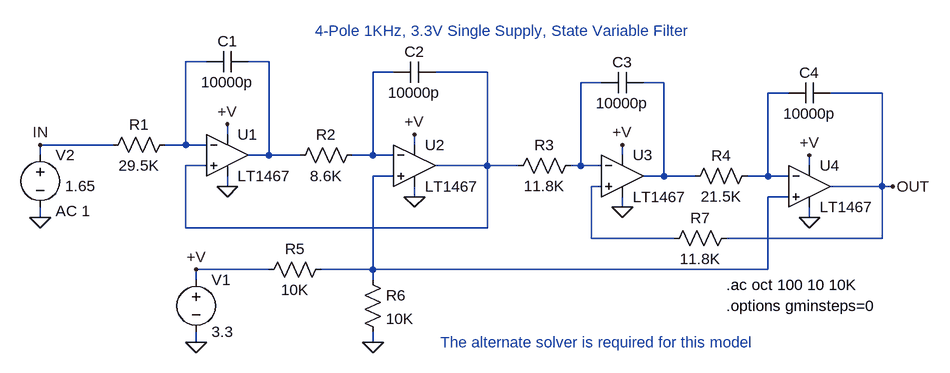
[diagram p0: schematic 1467.asc]
1467.asc, the LTspice schematic file:
Version 4
SHEET 1 1388 720
WIRE 224 -32 192 -32
WIRE 320 -32 288 -32
WIRE 512 -16 480 -16
WIRE 656 -16 576 -16
WIRE 832 0 800 0
WIRE 928 0 896 0
WIRE 1120 16 1088 16
WIRE 1264 16 1184 16
WIRE 256 80 256 64
WIRE 80 96 -32 96
WIRE 192 96 192 -32
WIRE 192 96 160 96
WIRE 224 96 192 96
WIRE 544 96 544 80
WIRE -32 112 -32 96
WIRE 320 112 320 -32
WIRE 320 112 288 112
WIRE 368 112 320 112
WIRE 480 112 480 -16
WIRE 480 112 448 112
WIRE 512 112 480 112
WIRE 864 112 864 96
WIRE 224 128 192 128
WIRE 656 128 656 -16
WIRE 656 128 576 128
WIRE 704 128 656 128
WIRE 800 128 800 0
WIRE 800 128 784 128
WIRE 832 128 800 128
WIRE 1152 128 1152 112
WIRE 512 144 480 144
WIRE 928 144 928 0
WIRE 928 144 896 144
WIRE 976 144 928 144
WIRE 1088 144 1088 16
WIRE 1088 144 1056 144
WIRE 1120 144 1088 144
WIRE 256 160 256 144
WIRE 832 160 816 160
WIRE 1264 160 1264 16
WIRE 1264 160 1184 160
WIRE 1280 160 1264 160
WIRE 544 176 544 160
WIRE 1120 176 1088 176
WIRE 864 192 864 176
WIRE -32 208 -32 192
WIRE 1152 208 1152 192
WIRE 192 224 192 128
WIRE 656 224 656 128
WIRE 656 224 192 224
WIRE 816 240 816 160
WIRE 944 240 816 240
WIRE 1264 240 1264 160
WIRE 1264 240 1024 240
WIRE 320 288 208 288
WIRE 480 288 480 144
WIRE 480 288 400 288
WIRE 1088 288 1088 176
WIRE 1088 288 480 288
WIRE 208 304 208 288
WIRE 480 304 480 288
WIRE 208 400 208 384
WIRE 480 400 480 384
FLAG 208 400 0
FLAG 256 64 +V
FLAG 208 288 +V
FLAG 1280 160 OUT
FLAG -32 96 IN
FLAG -32 208 0
FLAG 544 80 +V
FLAG 864 96 +V
FLAG 1152 112 +V
FLAG 256 160 0
FLAG 544 176 0
FLAG 864 192 0
FLAG 1152 208 0
FLAG 480 400 0
SYMBOL voltage 208 288 R0
SYMATTR InstName V1
SYMATTR Value 3.3
SYMBOL res 176 80 R90
WINDOW 0 0 56 VBottom 0
WINDOW 3 32 56 VTop 0
SYMATTR InstName R1
SYMATTR Value 29.5K
SYMBOL voltage -32 96 R0
WINDOW 123 24 102 Left 0
WINDOW 39 0 0 Left 0
WINDOW 3 38 63 Left 0
SYMATTR Value2 AC 1
SYMATTR InstName V2
SYMATTR Value 1.65
SYMBOL cap 288 -48 R90
WINDOW 0 0 32 VBottom 0
WINDOW 3 32 32 VTop 0
SYMATTR InstName C1
SYMATTR Value 10000p
SYMBOL res 464 96 R90
WINDOW 0 0 56 VBottom 0
WINDOW 3 32 56 VTop 0
SYMATTR InstName R2
SYMATTR Value 8.6K
SYMBOL cap 576 -32 R90
WINDOW 0 0 32 VBottom 0
WINDOW 3 32 32 VTop 0
SYMATTR InstName C2
SYMATTR Value 10000p
SYMBOL res 800 112 R90
WINDOW 0 0 56 VBottom 0
WINDOW 3 32 56 VTop 0
SYMATTR InstName R3
SYMATTR Value 11.8K
SYMBOL cap 896 -16 R90
WINDOW 0 0 32 VBottom 0
WINDOW 3 32 32 VTop 0
SYMATTR InstName C3
SYMATTR Value 10000p
SYMBOL res 1072 128 R90
WINDOW 0 0 56 VBottom 0
WINDOW 3 32 56 VTop 0
SYMATTR InstName R4
SYMATTR Value 21.5K
SYMBOL cap 1184 0 R90
WINDOW 0 0 32 VBottom 0
WINDOW 3 32 32 VTop 0
SYMATTR InstName C4
SYMATTR Value 10000p
SYMBOL res 416 272 R90
WINDOW 0 0 56 VBottom 0
WINDOW 3 32 56 VTop 0
SYMATTR InstName R5
SYMATTR Value 10K
SYMBOL res 464 288 R0
SYMATTR InstName R6
SYMATTR Value 10K
SYMBOL res 1040 224 R90
WINDOW 0 0 56 VBottom 0
WINDOW 3 32 56 VTop 0
SYMATTR InstName R7
SYMATTR Value 11.8K
SYMBOL opamps\\LT1467 256 48 R0
SYMATTR InstName U1
SYMBOL opamps\\LT1467 544 64 R0
SYMATTR InstName U2
SYMBOL opamps\\LT1467 864 80 R0
SYMATTR InstName U3
SYMBOL opamps\\LT1467 1152 96 R0
SYMATTR InstName U4
TEXT 1024 312 Left 0 !.ac oct 100 10 10K
TEXT 680 -64 Bottom 0 ;4-Pole 1KHz, 3.3V Single Supply, State Variable Filter
TEXT 1024 344 Left 0 !.options gminsteps=0
TEXT 584 400 Left 0 ;The alternate solver is required for this model

The netlist it stands for:
* 1467.asc
V1 +V 0 3.3
R1 N001 IN 29.5K
V2 IN 0 1.65 AC 1
C1 N002 N001 10000p
R2 N003 N002 8.6K
C2 N004 N003 10000p
R3 N005 N004 11.8K
C3 N006 N005 10000p
R4 N007 N006 21.5K
C4 OUT N007 10000p
R5 N008 +V 10K
R6 N008 0 10K
R7 OUT N009 11.8K
XU1 N004 N001 +V 0 N002 LT1467  ; pins In+ In- V+ V- OUT
XU2 N008 N003 +V 0 N004 LT1467  ; pins In+ In- V+ V- OUT
XU3 N009 N005 +V 0 N006 LT1467  ; pins In+ In- V+ V- OUT
XU4 N008 N007 +V 0 OUT LT1467  ; pins In+ In- V+ V- OUT
.ac oct 100 10 10K
* 4-Pole 1KHz, 3.3V Single Supply, State Variable Filter
.options gminsteps=0
* The alternate solver is required for this model
.backanno
.end